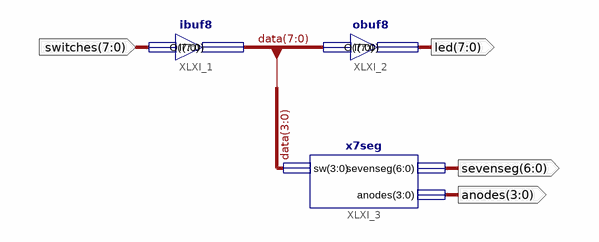
[diagram p0: schematic sheet 1]
// Xilinx ISE schematic toplevel21.sch (spartan3e) as structural Verilog: 3 symbols, 5 ports
module toplevel21 (
  input  [7:0] switches,
  output [7:0] data,
  output [7:0] led,
  output [3:0] anodes,
  output [6:0] sevenseg
);

  ibuf8 XLXI_1 (.I(switches), .O(data));
  obuf8 XLXI_2 (.I(data), .O(led));
  x7seg XLXI_3 (.sw(data[3:0]), .sevenseg(sevenseg), .anodes(anodes));
endmodule
